# Altium schematic sheet Gbe_Ethernet.SchDoc
size A3; SheetNumber: 1; SheetTotal: 4
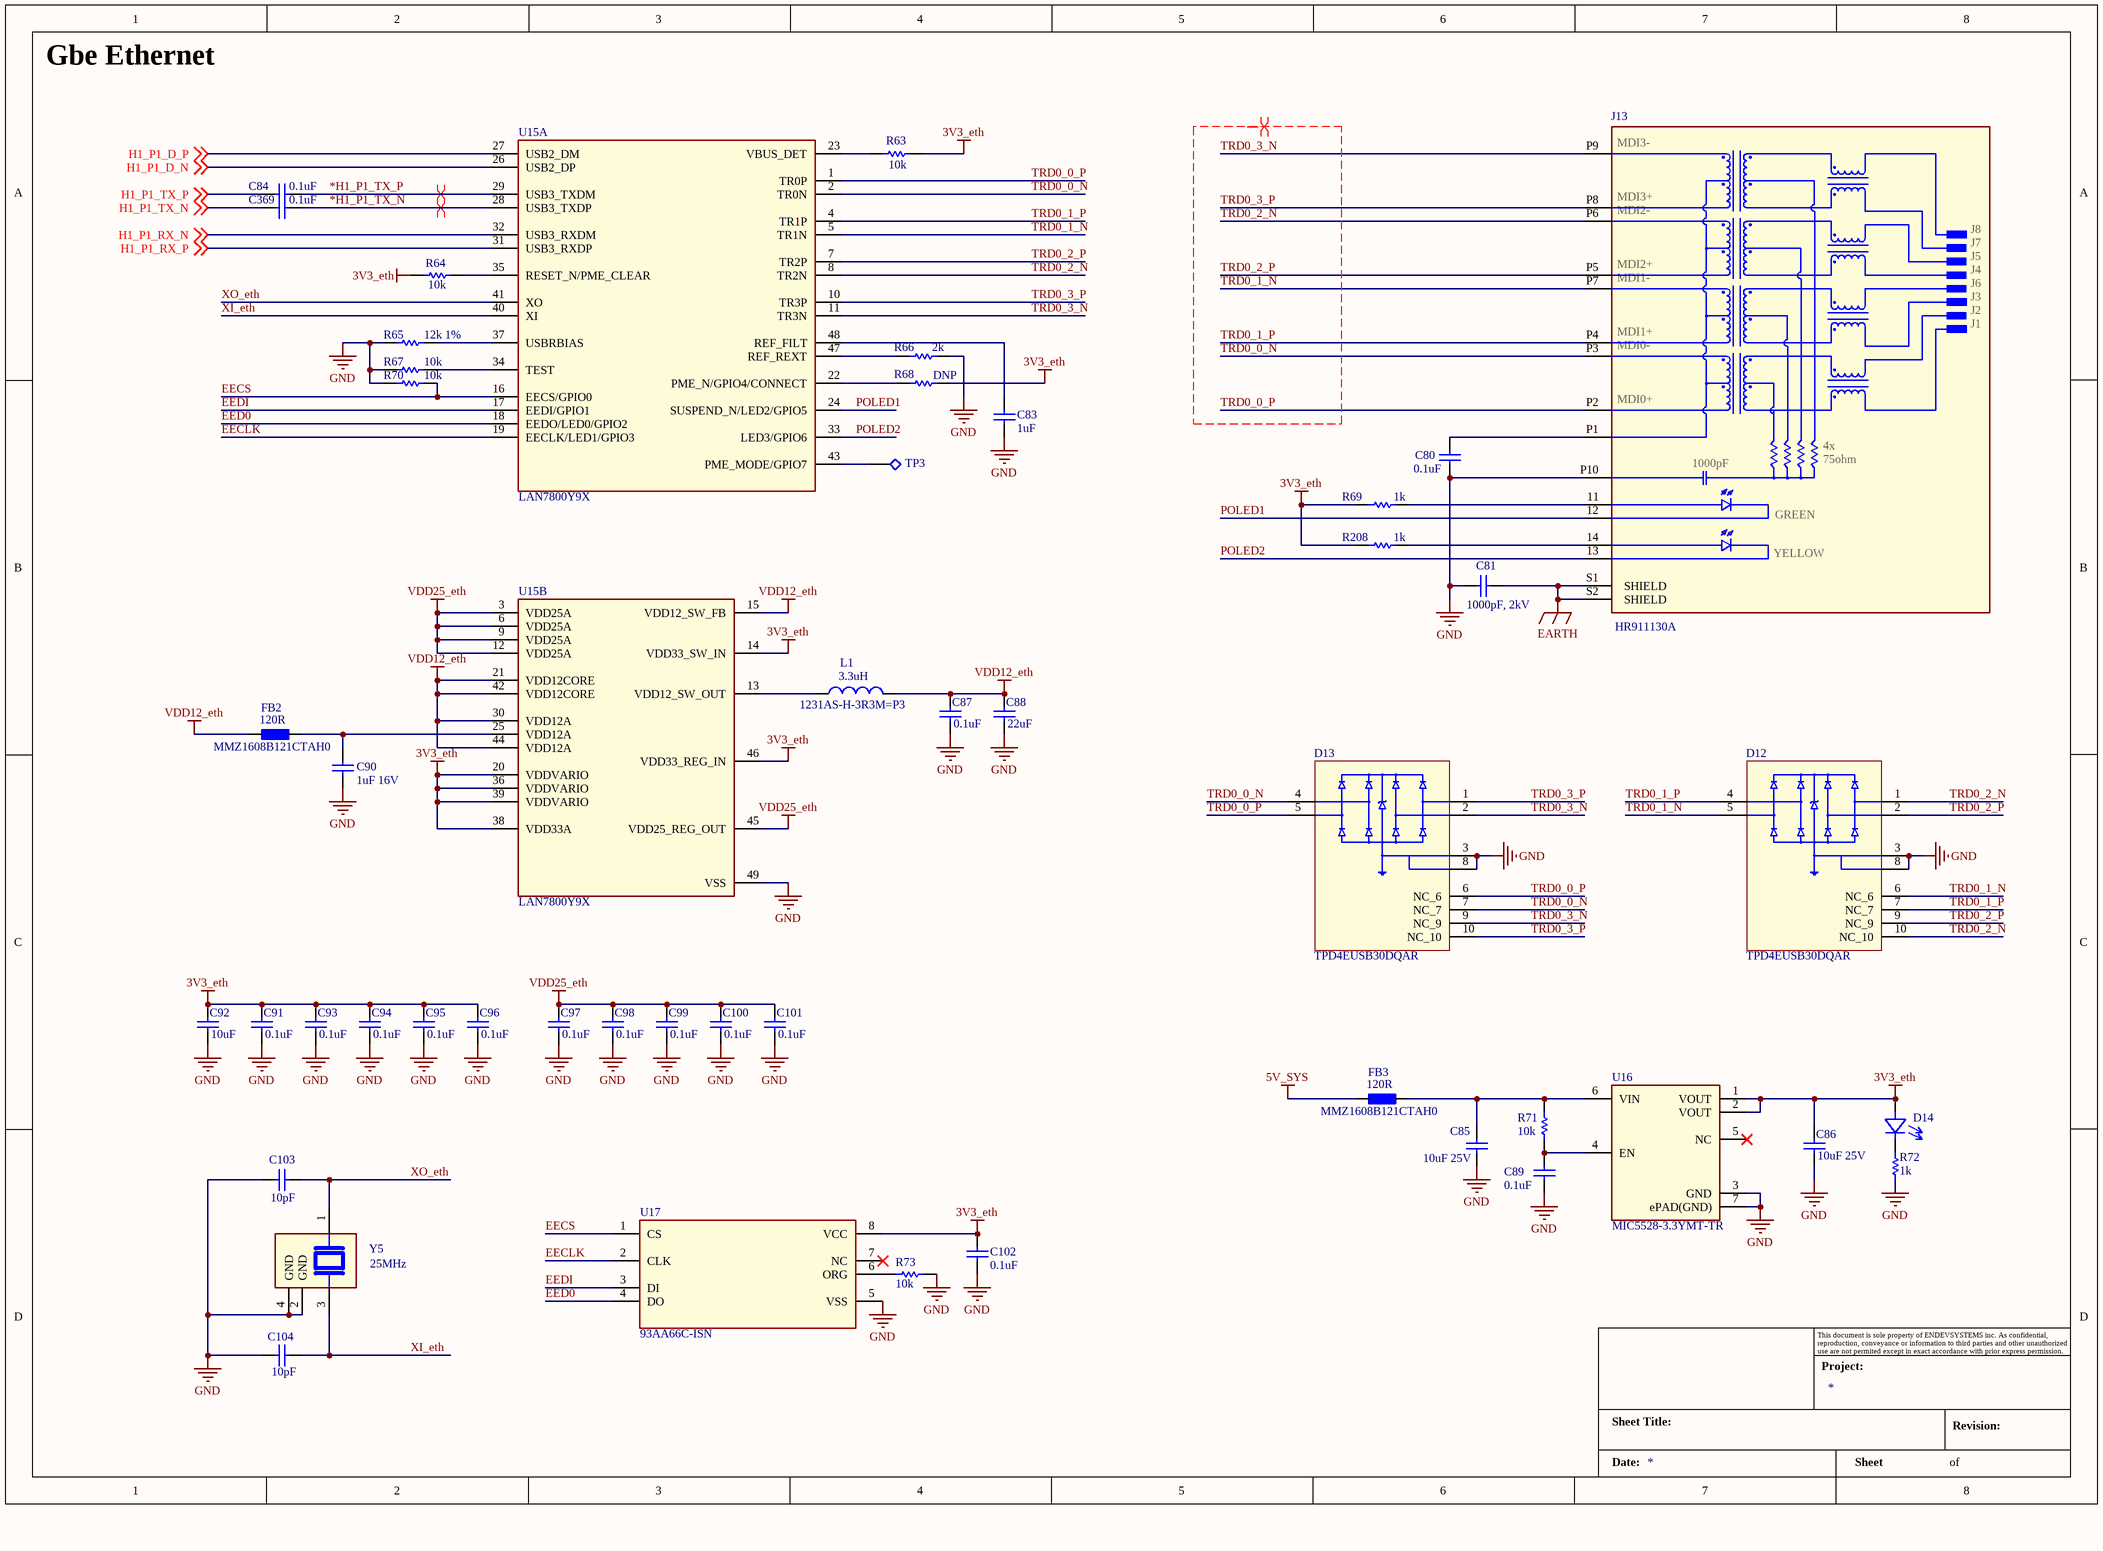
[diagram p0: Gbe_Ethernet.SchDoc]

## Parts
?  Title_Block  (value not drawn)  (graphical)
C80  0.1uF  [C-0402/1005]
C81  value 1000pF, 2kV  [C-0402/1005]  (hidden comment: 0.1uF)
C83  1uF  [C-0402/1005]
C84  0.1uF  [C-0402/1005]
C85  value 10uF 25V  [C-0402/1005]  (hidden comment: 0.1uF)
C86  value 10uF 25V  [C-0402/1005]  (hidden comment: 0.1uF)
C87  0.1uF  [C-0402/1005]
C88  22uF  [C-0402/1005]
C89  0.1uF  [C-0402/1005]
C90  1uF 16V  [C-0402/1005]
C91  0.1uF  [C-0402/1005]
C92  value 10uF  [C-0402/1005]  (hidden comment: 10uF 25V)
C93  0.1uF  [C-0402/1005]
C94  0.1uF  [C-0402/1005]
C95  0.1uF  [C-0402/1005]
C96  0.1uF  [C-0402/1005]
C97  0.1uF  [C-0402/1005]
C98  0.1uF  [C-0402/1005]
C99  0.1uF  [C-0402/1005]
C100  0.1uF  [C-0402/1005]
C101  0.1uF  [C-0402/1005]
C102  0.1uF  [C-0402/1005]
C103  10pF  [R-0402/1005]
C104  10pF  [R-0402/1005]
C369  0.1uF  [C-0402/1005]
D12  TPD4EUSB30DQAR  [IC_TPD4EUSB30DQAR]
D13  TPD4EUSB30DQAR  [IC_TPD4EUSB30DQAR]
D14  BRIGHT GREEN  [LEDC1608X65N]  (value not drawn)
FB2  MMZ1608B121CTAH0  value 120R  [R-0603/1608]
FB3  MMZ1608B121CTAH0  value 120R  [R-0603/1608]
J13  HR911130A  [HANRUN_HR911130A]
L1  1231AS-H-3R3M=P3  value 3.3uH  [0402-A]
R63  10k  [R-0402/1005]
R64  10k  [R-0402/1005]
R65  12k 1%  [R-0402/1005]
R66  2k  [R-0402/1005]
R67  10k  [R-0402/1005]
R68  DNP  [R-0402/1005]
R69  1k  [R-0402/1005]
R70  10k  [R-0402/1005]
R71  10k  [R-0402/1005]
R72  1k  [R-0402/1005]
R73  10k  [R-0402/1005]
R208  1k  [R-0402/1005]
TP3  Test Points  [Test Point TH Round H0.9,D1.6]  (value not drawn)
U15  LAN7800Y9X  [SQFN48_7X7_Y9X_MCH]  (parts A,B of 2)
U16  MIC5528-3.3YMT-TR  [SON40P120X120X60-7N]
U17  93AA66C-ISN  [SOIC8-N_MC_MCH]
Y5  value 25MHz  [ECS-250-10-37B2]  (hidden comment: ECS-250-10-37B2-CKM-TR)

## Nets
3V3_eth: C86.2 C91.2 C92.2 C93.2 C94.2 C95.2 C96.2 C102.2 D14.A R63.1 R64.1 R68.1 R69.1 R208.1 U15.14(VDD33_SW_IN) U15.20(VDDVARIO) U15.36(VDDVARIO) U15.38(VDD33A) U15.39(VDDVARIO) U15.46(VDD33_REG_IN) U16.1(VOUT) U16.2(VOUT) U17.8(VCC)
5V_SYS: FB3.2
EARTH: C81.2 J13.S1(SHIELD) J13.S2(SHIELD)
GND: C80.2 C81.1 C83.2 C85.1 C86.1 C87.1 C88.1 C89.1 C90.2 C91.1 C92.1 C93.1 C94.1 C95.1 C96.1 C97.1 C98.1 C99.1 C100.1 C101.1 C102.1 C103.2 C104.2 D12.3(GND_3) D12.8(GND_8) D13.3(GND_3) D13.8(GND_8) J13.P10 R65.2 R66.1 R67.2 R70.2 R72.2 R73.2 U15.49(VSS) U16.3(GND) U16.7(ePAD(GND)) U17.5(VSS) Y5.2(GND) Y5.4(GND)
VDD12_eth: C87.2 C88.2 FB2.2 L1.2 U15.15(VDD12_SW_FB) U15.21(VDD12CORE) U15.30(VDD12A) U15.42(VDD12CORE) U15.44(VDD12A)
VDD25_eth: C97.2 C98.2 C99.2 C100.2 C101.2 U15.3(VDD25A) U15.6(VDD25A) U15.9(VDD25A) U15.12(VDD25A) U15.45(VDD25_REG_OUT)
*H1_P1_TX_N: C369.1 U15.28(USB3_TXDP)
*H1_P1_TX_P: C84.1 U15.29(USB3_TXDM)
EECLK: U15.19(EECLK/LED1/GPIO3) U17.2(CLK)
EECS: R70.1 U15.16(EECS/GPIO0) U17.1(CS)
EED0: U15.18(EEDO/LED0/GPIO2) U17.4(DO)
EEDI: U15.17(EEDI/GPIO1) U17.3(DI)
H1_P1_D_N: U15.26(USB2_DP) ; off-sheet H1_P1_D_N
H1_P1_D_P: U15.27(USB2_DM) ; off-sheet H1_P1_D_P
H1_P1_RX_N: U15.32(USB3_RXDM) ; off-sheet H1_P1_RX_N
H1_P1_RX_P: U15.31(USB3_RXDP) ; off-sheet H1_P1_RX_P
H1_P1_TX_N: C369.2 ; off-sheet H1_P1_TX_N
H1_P1_TX_P: C84.2 ; off-sheet H1_P1_TX_P
POLED1: J13.12 U15.24(SUSPEND_N/LED2/GPIO5)
POLED2: J13.13 U15.33(LED3/GPIO6)
TRD0_0_N: D13.4(D2+) D13.7(NC_7) J13.P3 U15.2(TR0N)
TRD0_0_P: D13.5(D2-) D13.6(NC_6) J13.P2 U15.1(TR0P)
TRD0_1_N: D12.5(D2-) D12.6(NC_6) J13.P7 U15.5(TR1N)
TRD0_1_P: D12.4(D2+) D12.7(NC_7) J13.P4 U15.4(TR1P)
TRD0_2_N: D12.1(D1+) D12.10(NC_10) J13.P6 U15.8(TR2N)
TRD0_2_P: D12.2(D1-) D12.9(NC_9) J13.P5 U15.7(TR2P)
TRD0_3_N: D13.2(D1-) D13.9(NC_9) J13.P9 U15.11(TR3N)
TRD0_3_P: D13.1(D1+) D13.10(NC_10) J13.P8 U15.10(TR3P)
XI_eth: C104.1 U15.40(XI) Y5.3
XO_eth: C103.1 U15.41(XO) Y5.1
NetC80_1: C80.1 J13.P1
NetC83_1: C83.1 U15.48(REF_FILT)
NetC85_2: C85.2 FB3.1 R71.1 U16.6(VIN)
NetC89_2: C89.2 R71.2 U16.4(EN)
NetC90_1: C90.1 FB2.1 U15.25(VDD12A)
NetJ13_11: J13.11 R69.2
NetJ13_14: J13.14 R208.2
NetL1_1: L1.1 U15.13(VDD12_SW_OUT)
NetR63_2: R63.2 U15.23(VBUS_DET)
NetR64_2: R64.2 U15.35(RESET_N/PME_CLEAR)
NetR65_1: R65.1 U15.37(USBRBIAS)
NetR66_2: R66.2 U15.47(REF_REXT)
NetR67_1: R67.1 U15.34(TEST)
NetR68_2: R68.2 U15.22(PME_N/GPIO4/CONNECT)
NetR73_1: R73.1 U17.6(ORG)
NetTP3_1: TP3.1 U15.43(PME_MODE/GPIO7)

Not connected (* = marked no-connect by the designer): D14 C; R72 1; U16 5(NC)*; U17 7(NC)*

## Layout directives
differential pair; differential pair class Diff_100R: TRD0_0_N, TRD0_0_P, TRD0_1_N, TRD0_1_P, TRD0_2_N, TRD0_2_P, TRD0_3_N, TRD0_3_P
differential pair; differential pair class Diff_90R: *H1_P1_TX_N, *H1_P1_TX_P

## Notes on the sheet
- Gbe Ethernet
- (in symbol Title_Block) This document is sole property of ENDEVSYSTEMS inc. As confidential, reproduction, conveyance or information to third parties and other unauthorized use are not permited except in exact accordance with prior express permission.; Project:; Sheet Title:; Revision:; Date:; Sheet; of

## Library data of the parts
C80 C81 C84-C87 C89-C91 C93-C102 C369 = Cap: Capacitor; Published: 8-Jun-2000; LatestRevisionDate: 17-Jul-2002; LatestRevisionNote: Re-released for DXP Platform.; PackageReference: RAD-0.3; Publisher: Altium Limited; PackageDescription: Radial Cap, Thru-Hole; 2 Leads; 0.3 in Pin Spacing
  C80 C84 C87 C89 C91 C93-C102 C369: Value: 0.1uF
  C90: Value: 1uF 16V
C83 = Cap: 1uF 16V; Published: 8-Jun-2000; LatestRevisionDate: 17-Jul-2002; LatestRevisionNote: Re-released for DXP Platform.; PackageReference: RAD-0.3; Publisher: Altium Limited; PackageDescription: Radial Cap, Thru-Hole; 2 Leads; 0.3 in Pin Spacing; Value: 1uF
C88 = Cap: 22uF 6.3V; Published: 8-Jun-2000; LatestRevisionDate: 17-Jul-2002; LatestRevisionNote: Re-released for DXP Platform.; PackageReference: RAD-0.3; Publisher: Altium Limited; PackageDescription: Radial Cap, Thru-Hole; 2 Leads; 0.3 in Pin Spacing; Value: 22uF
C92 = Cap: Published: 8-Jun-2000; LatestRevisionDate: 17-Jul-2002; LatestRevisionNote: Re-released for DXP Platform.; PackageReference: RAD-0.3; Publisher: Altium Limited; PackageDescription: Radial Cap, Thru-Hole; 2 Leads; 0.3 in Pin Spacing
C103 C104 = Cap: Capacitor; Value: 0.1uF; Published: 8-Jun-2000; LatestRevisionDate: 17-Jul-2002; LatestRevisionNote: Re-released for DXP Platform.; PackageReference: RAD-0.3; Publisher: Altium Limited; PackageDescription: Radial Cap, Thru-Hole; 2 Leads; 0.3 in Pin Spacing
D12 D13 = TPD4EUSB30DQAR: 4-channel ESD solution for SuperSpeed (6 Gbps) USB 3.0 interface 10-USON -40 to 85; Value: *; Package: None; MP: TPD4EUSB30DQAR; Price: None; Availability: Unavailable
D14 = Diode-LED: Supplier: Digikey Electronics
FB2 FB3 = BLM15H: FERRITE BEAD 120 OHM 0402 1LN; Mfr. Part No.: BLM15HB121SN1D; Unit Price (USD): 0.19; Supplier Part No.: 490-4000-1-ND; Supplier: Digikey Electronics
J13 = HR911130A: Check availability; GateName_1: G$1; MF: hanrun; SymbolName_1: HR911130A; LibraryName: HR911130A; DeviceSetName: HR911130A; AVAILABILITY: Not in stock; MP: HR911130A; PACKAGE: None; PRICE: None; YELLOW: YELLOW; GREEN: GREEN; 75ohm: 75ohm; 1000pF: 1000pF; 4x: 4x; MDI3-: MDI3-; MDI3+: MDI3+; MDI2-: MDI2-; MDI2+: MDI2+; MDI1-: MDI1-; MDI1+: MDI1+; MDI0-: MDI0-; MDI0+: MDI0+; J8: J8; J7: J7; J5: J5; J4: J4; J6: J6; J3: J3; J2: J2; J1: J1
L1 = Inductor: Code_IEC: 1005; Published: 8-Jun-2000; LatestRevisionDate: 29-May-2009; LatestRevisionNote: IPC-7351 Footprint Added.; PackageReference: 0402-A; Publisher: Altium Limited; PackageDescription: Chip Inductor; Code_JEITA: 0402
R63 R64 R71 R73 = Res1: Resistor; Published: 8-Jun-2000; LatestRevisionDate: 17-Jul-2002; LatestRevisionNote: Re-released for DXP Platform.; PackageReference: AXIAL-0.3; Publisher: Altium Limited; PackageDescription: Axial Device, Thru-Hole; 2 Leads; 0.3 in Pin Spacing; Value: 10K
R65 R67 R70 = Res1: Resistor; Value: 200K; Published: 8-Jun-2000; LatestRevisionDate: 17-Jul-2002; LatestRevisionNote: Re-released for DXP Platform.; PackageReference: AXIAL-0.3; Publisher: Altium Limited; PackageDescription: Axial Device, Thru-Hole; 2 Leads; 0.3 in Pin Spacing
R66 R68 R69 R72 R208 = Res1: Resistor; Value: 10K; Published: 8-Jun-2000; LatestRevisionDate: 17-Jul-2002; LatestRevisionNote: Re-released for DXP Platform.; PackageReference: AXIAL-0.3; Publisher: Altium Limited; PackageDescription: Axial Device, Thru-Hole; 2 Leads; 0.3 in Pin Spacing
U15 = LAN7800Y9X: Ethernet Controller 10/100/1000 Base-TX PHY - Interface 48-SQFN (7x7); Mfr_Name: Microchip; RefDes: RefDes; Type: Type
U16 = MIC5528-3.3YMT-TR: IC REG LINEAR 3.3V 500MA 6TDFN; MF: Microchip; Package: TDFN-6 Microchip; MP: MIC5528-3.3YMT-TR; Value: *; SnapEDA_Link: https://www.snapeda.com/parts/MIC5528-3.3YMT-TR/Microchip/view-part/587087/?ref=snap; Price: None; Availability: Unavailable
U17 = 93AA66C-ISN: Microwire Serial EEPROM Family, 1.8 to 5.5V, 3 MHz, -40°Cto 125°C, SOIC-8, RoHS; Mfr_Name: Microchip; RefDes: RefDes; Type: Type
? = Title_Block: Date:: *; Project:: *